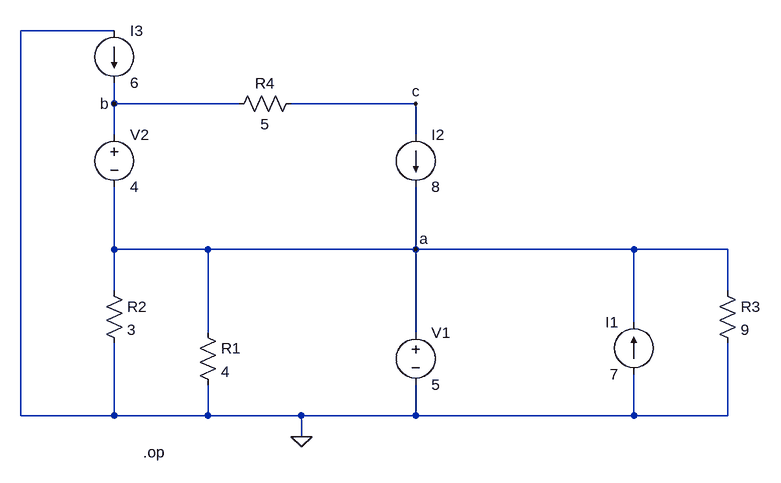
[diagram p0: schematic ooftest.asc]
ooftest.asc, the LTspice schematic file:
Version 4
SHEET 1 984 680
WIRE -16 -336 -160 -336
WIRE -16 -224 -16 -256
WIRE 176 -224 -16 -224
WIRE 448 -224 256 -224
WIRE -16 -176 -16 -224
WIRE 448 -176 448 -224
WIRE -16 0 -16 -96
WIRE 128 0 -16 0
WIRE 448 0 448 -96
WIRE 448 0 128 0
WIRE 784 0 448 0
WIRE 928 0 784 0
WIRE -16 64 -16 0
WIRE 928 64 928 0
WIRE 784 112 784 0
WIRE 128 128 128 0
WIRE 448 128 448 0
WIRE -160 256 -160 -336
WIRE -16 256 -16 144
WIRE -16 256 -160 256
WIRE 128 256 128 208
WIRE 128 256 -16 256
WIRE 272 256 128 256
WIRE 448 256 448 208
WIRE 448 256 272 256
WIRE 784 256 784 192
WIRE 784 256 448 256
WIRE 928 256 928 144
WIRE 928 256 784 256
WIRE 272 288 272 256
FLAG 272 288 0
FLAG 448 0 a
FLAG -16 -224 b
FLAG 448 -224 c
SYMBOL res 112 112 R0
SYMATTR InstName R1
SYMATTR Value 4
SYMBOL voltage 448 112 R0
SYMATTR InstName V1
SYMATTR Value 5
SYMBOL current 784 192 R180
WINDOW 0 24 80 Left 2
WINDOW 3 24 0 Left 2
WINDOW 123 0 0 Left 0
WINDOW 39 0 0 Left 0
SYMATTR InstName I1
SYMATTR Value 7
SYMBOL res -32 48 R0
SYMATTR InstName R2
SYMATTR Value 3
SYMBOL res 912 48 R0
SYMATTR InstName R3
SYMATTR Value 9
SYMBOL current 448 -176 R0
SYMATTR InstName I2
SYMATTR Value 8
SYMBOL current -16 -336 R0
SYMATTR InstName I3
SYMATTR Value 6
SYMBOL voltage -16 -192 R0
SYMATTR InstName V2
SYMATTR Value 4
SYMBOL res 272 -240 R90
WINDOW 0 0 56 VBottom 2
WINDOW 3 32 56 VTop 2
SYMATTR InstName R4
SYMATTR Value 5
TEXT 28 312 Left 2 !.op

The netlist it stands for:
* ooftest.asc
R1 a 0 4
V1 a 0 5
I1 0 a 7
R2 a 0 3
R3 a 0 9
I2 c a 8
I3 0 b 6
V2 b a 4
R4 c b 5
.op
.backanno
.end